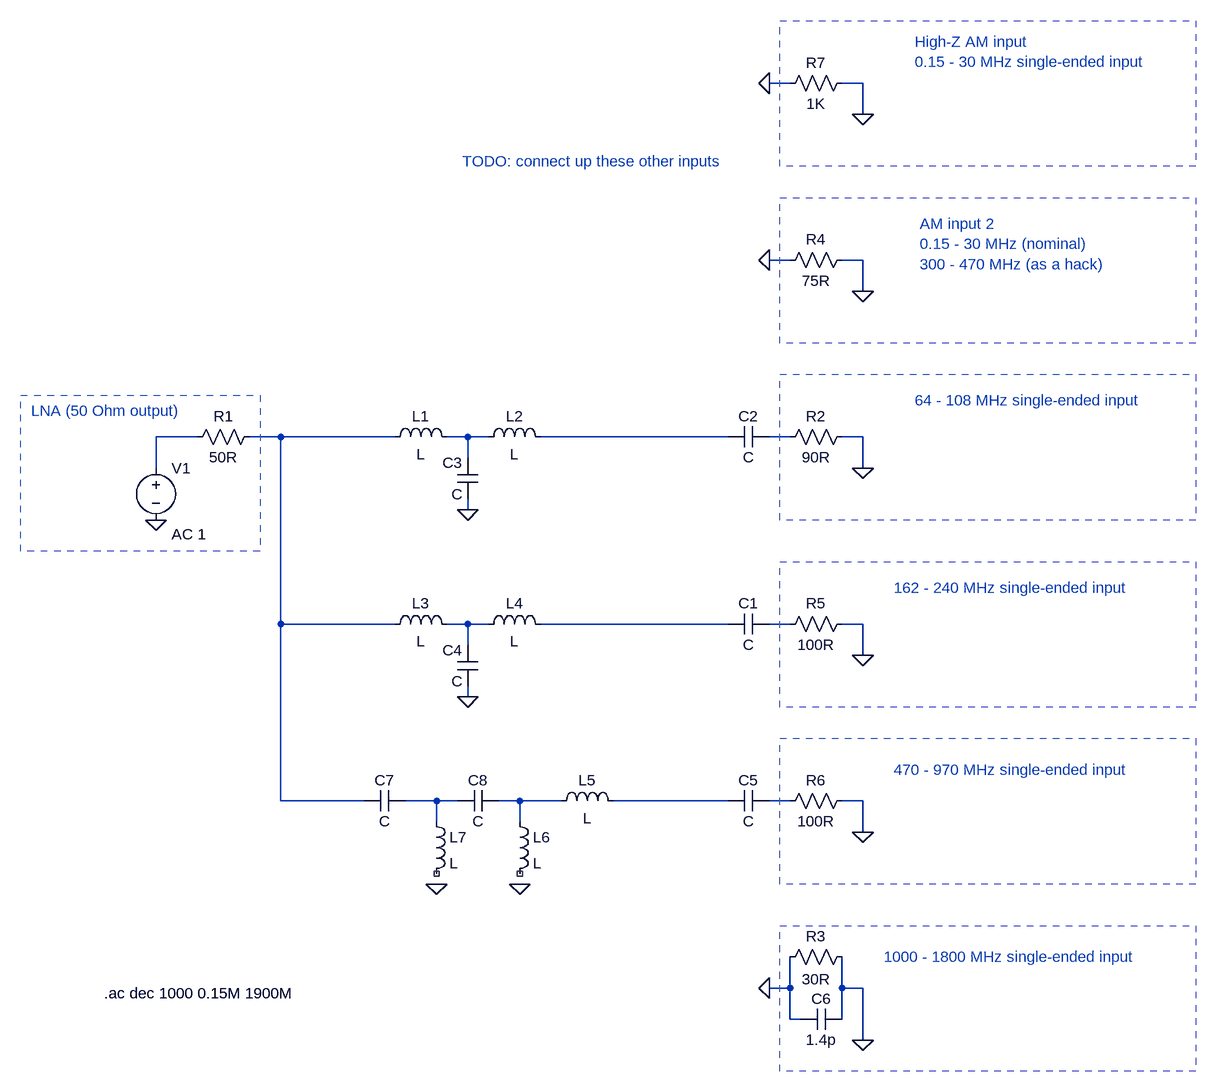
[diagram p0: schematic antenna_input_coupling.asc]
antenna_input_coupling.asc, the LTspice schematic file:
Version 4
SHEET 1 1332 1656
WIRE 464 -128 432 -128
WIRE 576 -128 544 -128
WIRE 576 -80 576 -128
WIRE 464 144 432 144
WIRE 576 144 544 144
WIRE 576 192 576 144
WIRE -448 416 -512 416
WIRE -320 416 -368 416
WIRE -144 416 -320 416
WIRE -32 416 -64 416
WIRE 0 416 -32 416
WIRE 368 416 80 416
WIRE 464 416 432 416
WIRE 576 416 544 416
WIRE -32 448 -32 416
WIRE -512 464 -512 416
WIRE 576 464 576 416
WIRE -32 528 -32 512
WIRE -320 704 -320 416
WIRE -144 704 -320 704
WIRE -32 704 -64 704
WIRE 0 704 -32 704
WIRE 368 704 80 704
WIRE 464 704 432 704
WIRE 576 704 544 704
WIRE -32 736 -32 704
WIRE 576 752 576 704
WIRE -32 816 -32 800
WIRE -320 976 -320 704
WIRE -192 976 -320 976
WIRE -80 976 -128 976
WIRE -48 976 -80 976
WIRE 48 976 16 976
WIRE 112 976 48 976
WIRE 368 976 192 976
WIRE 464 976 432 976
WIRE 576 976 544 976
WIRE -80 1008 -80 976
WIRE 48 1008 48 976
WIRE 576 1024 576 976
WIRE 464 1264 464 1216
WIRE 464 1264 432 1264
WIRE 544 1264 544 1216
WIRE 576 1264 544 1264
WIRE 464 1312 464 1264
WIRE 480 1312 464 1312
WIRE 544 1312 544 1264
WIRE 576 1344 576 1264
FLAG -512 544 0
FLAG -32 528 0
FLAG 576 464 0
FLAG -32 816 0
FLAG 576 752 0
FLAG 576 1024 0
FLAG 576 1344 0
FLAG 576 192 0
FLAG 576 -80 0
FLAG 48 1104 0
FLAG -80 1104 0
FLAG 432 -128 0
FLAG 432 144 0
FLAG 432 1264 0
SYMBOL res -352 400 R90
WINDOW 0 0 56 VBottom 2
WINDOW 3 32 56 VTop 2
SYMATTR InstName R1
SYMATTR Value 50R
SYMBOL voltage -512 448 R0
WINDOW 123 24 118 Left 2
SYMATTR Value2 AC 1
SYMATTR InstName V1
SYMATTR Value ""
SYMBOL ind -160 432 R270
WINDOW 0 32 56 VTop 2
WINDOW 3 5 56 VBottom 2
SYMATTR InstName L1
SYMBOL cap 432 400 R90
WINDOW 0 0 32 VBottom 2
WINDOW 3 32 32 VTop 2
SYMATTR InstName C2
SYMBOL cap -16 512 R180
WINDOW 0 24 56 Left 2
WINDOW 3 24 8 Left 2
SYMATTR InstName C3
SYMBOL ind -16 432 R270
WINDOW 0 32 56 VTop 2
WINDOW 3 5 56 VBottom 2
SYMATTR InstName L2
SYMBOL res 560 400 R90
WINDOW 0 0 56 VBottom 2
WINDOW 3 32 56 VTop 2
SYMATTR InstName R2
SYMATTR Value 90R
SYMBOL ind -160 720 R270
WINDOW 0 32 56 VTop 2
WINDOW 3 5 56 VBottom 2
SYMATTR InstName L3
SYMBOL cap 432 688 R90
WINDOW 0 0 32 VBottom 2
WINDOW 3 32 32 VTop 2
SYMATTR InstName C1
SYMBOL cap -16 800 R180
WINDOW 0 24 56 Left 2
WINDOW 3 24 8 Left 2
SYMATTR InstName C4
SYMBOL ind -16 720 R270
WINDOW 0 32 56 VTop 2
WINDOW 3 5 56 VBottom 2
SYMATTR InstName L4
SYMBOL cap 432 960 R90
WINDOW 0 0 32 VBottom 2
WINDOW 3 32 32 VTop 2
SYMATTR InstName C5
SYMBOL res 560 688 R90
WINDOW 0 0 56 VBottom 2
WINDOW 3 32 56 VTop 2
SYMATTR InstName R5
SYMATTR Value 100R
SYMBOL res 560 960 R90
WINDOW 0 0 56 VBottom 2
WINDOW 3 32 56 VTop 2
SYMATTR InstName R6
SYMATTR Value 100R
SYMBOL res 560 1200 R90
WINDOW 0 0 56 VBottom 2
WINDOW 3 35 56 VTop 2
SYMATTR InstName R3
SYMATTR Value 30R
SYMBOL res 560 128 R90
WINDOW 0 0 56 VBottom 2
WINDOW 3 32 56 VTop 2
SYMATTR InstName R4
SYMATTR Value 75R
SYMBOL res 560 -144 R90
WINDOW 0 0 56 VBottom 2
WINDOW 3 32 56 VTop 2
SYMATTR InstName R7
SYMATTR Value 1K
SYMBOL cap 480 1328 R270
WINDOW 0 32 32 VTop 2
WINDOW 3 0 32 VBottom 2
SYMATTR InstName C6
SYMATTR Value 1.4p
SYMBOL cap -192 992 R270
WINDOW 0 32 32 VTop 2
WINDOW 3 0 32 VBottom 2
SYMATTR InstName C7
SYMBOL cap -48 992 R270
WINDOW 0 32 32 VTop 2
WINDOW 3 0 32 VBottom 2
SYMATTR InstName C8
SYMBOL ind 96 992 R270
WINDOW 0 32 56 VTop 2
WINDOW 3 5 56 VBottom 2
SYMATTR InstName L5
SYMBOL ind 32 992 R0
SYMATTR InstName L6
SYMBOL ind -96 992 R0
SYMATTR InstName L7
TEXT -592 1272 Left 2 !.ac dec 1000 0.15M 1900M
TEXT -704 376 Left 2 ;LNA (50 Ohm output)
TEXT 656 360 Left 2 ;64 - 108 MHz single-ended input
TEXT 624 648 Left 2 ;162 - 240 MHz single-ended input
TEXT 624 928 Left 2 ;470 - 970 MHz single-ended input
TEXT 608 1216 Left 2 ;1000 - 1800 MHz single-ended input
TEXT 664 88 Left 2 ;AM input 2\n0.15 - 30 MHz (nominal)\n300 - 470 MHz (as a hack)
TEXT 656 -192 Left 2 ;High-Z AM input\n0.15 - 30 MHz single-ended input
TEXT -40 -8 Left 2 ;TODO: connect up these other inputs
RECTANGLE Normal -720 352 -352 592 2
RECTANGLE Normal 1088 544 448 320 2
RECTANGLE Normal 1088 832 448 608 2
RECTANGLE Normal 1088 1104 448 880 2
RECTANGLE Normal 1088 1392 448 1168 2
RECTANGLE Normal 1088 272 448 48 2
RECTANGLE Normal 1088 0 448 -224 2

The netlist it stands for:
* antenna_input_coupling.asc
R1 N002 N001 50R
V1 N001 0 AC 1
L1 N002 N003 L
C2 N005 N004 C
C3 0 N003 C
L2 N003 N004 L
R2 0 N005 90R
L3 N002 N006 L
C1 N008 N007 C
C4 0 N006 C
L4 N006 N007 L
C5 N012 N011 C
R5 0 N008 100R
R6 0 N012 100R
R3 0 0 30R
R4 0 0 75R
R7 0 0 1K
C6 0 0 1.4p
C7 N002 N009 C
C8 N009 N010 C
L5 N010 N011 L
L6 N010 NC_01 L
L7 N009 NC_02 L
.ac dec 1000 0.15M 1900M
* LNA (50 Ohm output)
* 64 - 108 MHz single-ended input
* 162 - 240 MHz single-ended input
* 470 - 970 MHz single-ended input
* 1000 - 1800 MHz single-ended input
* AM input 2
* 0.15 - 30 MHz (nominal)
* 300 - 470 MHz (as a hack)
* High-Z AM input
* 0.15 - 30 MHz single-ended input
* TODO: connect up these other inputs
.backanno
.end